# Altium schematic sheet bolid-mcu.SchDoc
size A3
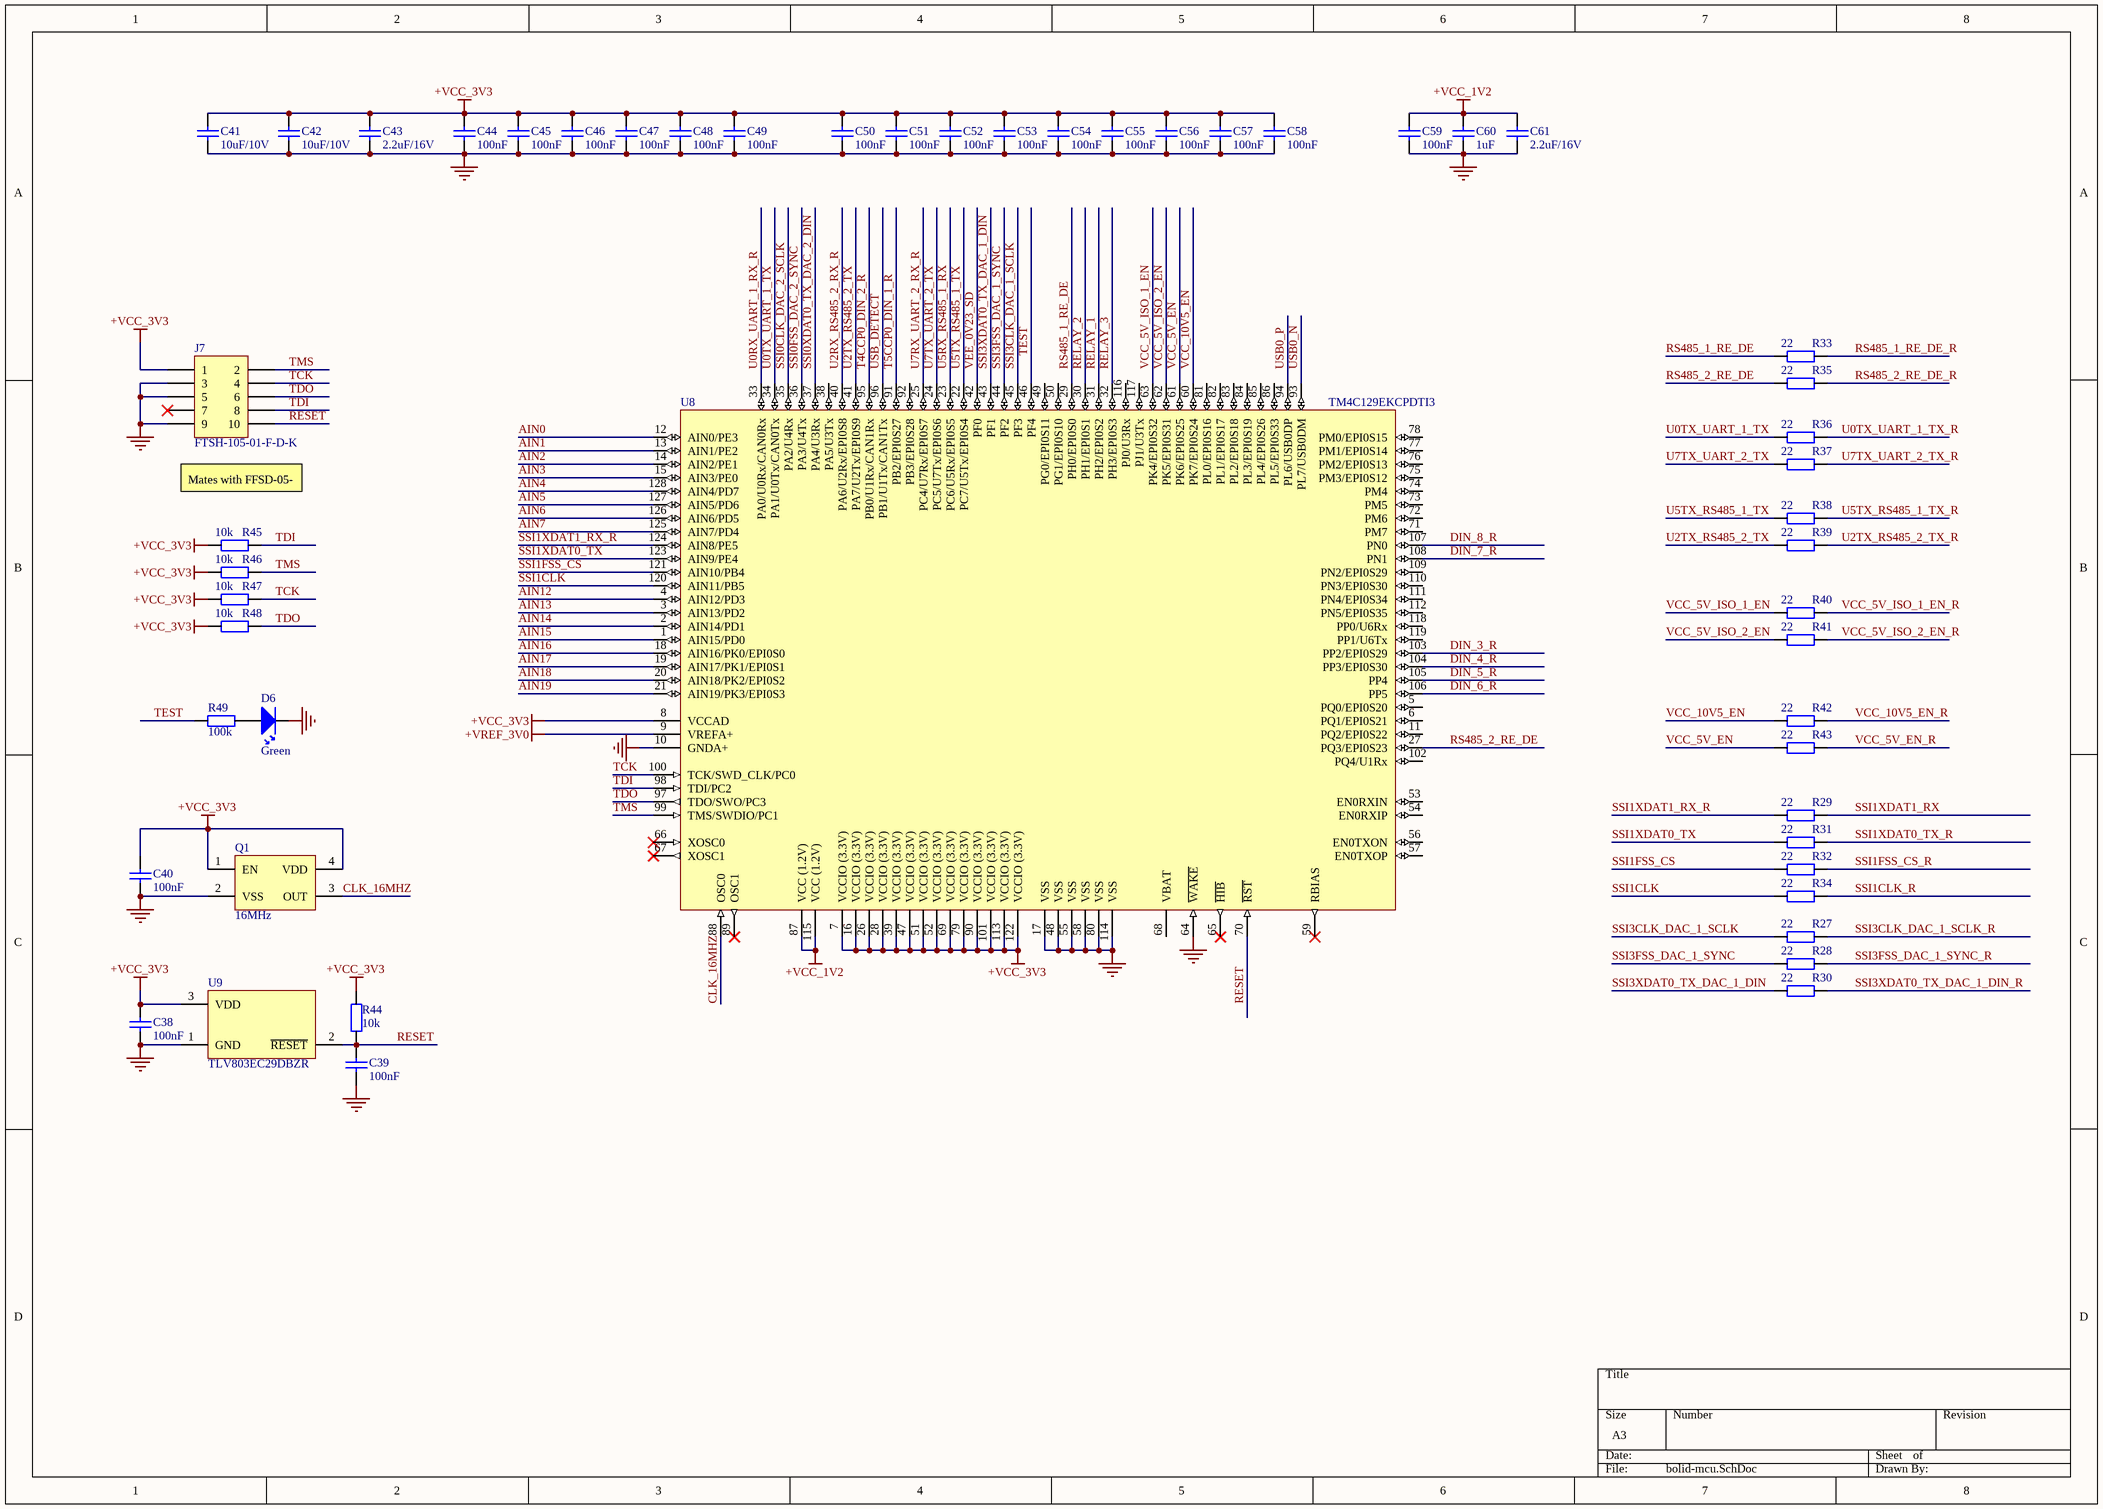
[diagram p0: bolid-mcu.SchDoc]

## Parts
C38  Value Displayed: 100nF  [C0402-CAPC100X50X55L22 - Tayio Yuden TDK]  (hidden comment: GRM155R71H104KE14D)
C39  Value Displayed: 100nF  [C0402-CAPC100X50X55L22 - Tayio Yuden TDK]  (hidden comment: GRM155R71H104KE14D)
C40  Value Displayed: 100nF  [C0402-CAPC100X50X55L22 - Tayio Yuden TDK]  (hidden comment: GRM155R71H104KE14D)
C41  Value Displayed: 10uF/10V  [C0805-CAPC200X125X135L50N - Taiyo YudenN]  (hidden comment: GRM21BR71A106KA73K)
C42  Value Displayed: 10uF/10V  [C0805-CAPC200X125X135L50N - Taiyo YudenN]  (hidden comment: GRM21BR71A106KA73K)
C43  Value Displayed: 2.2uF/16V  [C0603-CAPC162X80X95L35N]  (hidden comment: EMK107BB7225MA-T)
C44  Value Displayed: 100nF  [C0402-CAPC100X50X55L22 - Tayio Yuden TDK]  (hidden comment: GRM155R71H104KE14D)
C45  Value Displayed: 100nF  [C0402-CAPC100X50X55L22 - Tayio Yuden TDK]  (hidden comment: GRM155R71H104KE14D)
C46  Value Displayed: 100nF  [C0402-CAPC100X50X55L22 - Tayio Yuden TDK]  (hidden comment: GRM155R71H104KE14D)
C47  Value Displayed: 100nF  [C0402-CAPC100X50X55L22 - Tayio Yuden TDK]  (hidden comment: GRM155R71H104KE14D)
C48  Value Displayed: 100nF  [C0402-CAPC100X50X55L22 - Tayio Yuden TDK]  (hidden comment: GRM155R71H104KE14D)
C49  Value Displayed: 100nF  [C0402-CAPC100X50X55L22 - Tayio Yuden TDK]  (hidden comment: GRM155R71H104KE14D)
C50  Value Displayed: 100nF  [C0402-CAPC100X50X55L22 - Tayio Yuden TDK]  (hidden comment: GRM155R71H104KE14D)
C51  Value Displayed: 100nF  [C0402-CAPC100X50X55L22 - Tayio Yuden TDK]  (hidden comment: GRM155R71H104KE14D)
C52  Value Displayed: 100nF  [C0402-CAPC100X50X55L22 - Tayio Yuden TDK]  (hidden comment: GRM155R71H104KE14D)
C53  Value Displayed: 100nF  [C0402-CAPC100X50X55L22 - Tayio Yuden TDK]  (hidden comment: GRM155R71H104KE14D)
C54  Value Displayed: 100nF  [C0402-CAPC100X50X55L22 - Tayio Yuden TDK]  (hidden comment: GRM155R71H104KE14D)
C55  Value Displayed: 100nF  [C0402-CAPC100X50X55L22 - Tayio Yuden TDK]  (hidden comment: GRM155R71H104KE14D)
C56  Value Displayed: 100nF  [C0402-CAPC100X50X55L22 - Tayio Yuden TDK]  (hidden comment: GRM155R71H104KE14D)
C57  Value Displayed: 100nF  [C0402-CAPC100X50X55L22 - Tayio Yuden TDK]  (hidden comment: GRM155R71H104KE14D)
C58  Value Displayed: 100nF  [C0402-CAPC100X50X55L22 - Tayio Yuden TDK]  (hidden comment: GRM155R71H104KE14D)
C59  Value Displayed: 100nF  [C0402-CAPC100X50X55L22 - Tayio Yuden TDK]  (hidden comment: GRM155R71H104KE14D)
C60  Value Displayed: 1uF  [C0603-CAPC162X80X95L35N]  (hidden comment: UMK107AB7105KA-T)
C61  Value Displayed: 2.2uF/16V  [C0603-CAPC162X80X95L35N]  (hidden comment: EMK107BB7225MA-T)
D6  Illumination Color: Green  [D0603 DIONC166X84X36L42N Littelfuse]  (hidden comment: 150060GS75000)
J7  FTSH-105-01-F-D-K  [SAMTEC-FTSH-105-01-F-D-K]
Q1  value 16MHz  [ECS ECS-2520S OSCCC250X200X100L67X77]  (hidden comment: ECS-2520MVLC-160-CN-TR)
R27  value 22  [R0402-RESC100X50X40L22N]  (hidden comment: RC0402FR-1322RL)
R28  value 22  [R0402-RESC100X50X40L22N]  (hidden comment: RC0402FR-1322RL)
R29  value 22  [R0402-RESC100X50X40L22N]  (hidden comment: RC0402FR-1322RL)
R30  value 22  [R0402-RESC100X50X40L22N]  (hidden comment: RC0402FR-1322RL)
R31  value 22  [R0402-RESC100X50X40L22N]  (hidden comment: RC0402FR-1322RL)
R32  value 22  [R0402-RESC100X50X40L22N]  (hidden comment: RC0402FR-1322RL)
R33  value 22  [R0402-RESC100X50X40L22N]  (hidden comment: RC0402FR-1322RL)
R34  value 22  [R0402-RESC100X50X40L22N]  (hidden comment: RC0402FR-1322RL)
R35  value 22  [R0402-RESC100X50X40L22N]  (hidden comment: RC0402FR-1322RL)
R36  value 22  [R0402-RESC100X50X40L22N]  (hidden comment: RC0402FR-1322RL)
R37  value 22  [R0402-RESC100X50X40L22N]  (hidden comment: RC0402FR-1322RL)
R38  value 22  [R0402-RESC100X50X40L22N]  (hidden comment: RC0402FR-1322RL)
R39  value 22  [R0402-RESC100X50X40L22N]  (hidden comment: RC0402FR-1322RL)
R40  value 22  [R0402-RESC100X50X40L22N]  (hidden comment: RC0402FR-1322RL)
R41  value 22  [R0402-RESC100X50X40L22N]  (hidden comment: RC0402FR-1322RL)
R42  value 22  [R0402-RESC100X50X40L22N]  (hidden comment: RC0402FR-1322RL)
R43  value 22  [R0402-RESC100X50X40L22N]  (hidden comment: RC0402FR-1322RL)
R44  value 10k  [R0402-RESC100X50X40L22N]  (hidden comment: RC0402FR-0710KL)
R45  value 10k  [R0402-RESC100X50X40L22N]  (hidden comment: RC0402FR-0710KL)
R46  value 10k  [R0402-RESC100X50X40L22N]  (hidden comment: RC0402FR-0710KL)
R47  value 10k  [R0402-RESC100X50X40L22N]  (hidden comment: RC0402FR-0710KL)
R48  value 10k  [R0402-RESC100X50X40L22N]  (hidden comment: RC0402FR-0710KL)
R49  value 100k  [R0402-RESC100X50X40L22N]  (hidden comment: RC0402FR-07100KL)
U8  TM4C129EKCPDTI3  [TI TQFP128 PDT S-PQFP-G128 QFP128P40_1600X1600X105L60X18NN]
U9  TLV803EC29DBZR  [TI SOT23 DBZ0003A SOT23-3P95_237X112L40X40N]

## Nets
+VCC_1V2: C59.2 C60.2 C61.2 U8.87(VCC_(1.2V)) U8.115(VCC_(1.2V))
+VCC_3V3: C38.2 C40.2 C41.2 C42.2 C43.2 C44.2 C45.2 C46.2 C47.2 C48.2 C49.2 C50.2 C51.2 C52.2 C53.2 C54.2 C55.2 C56.2 C57.2 C58.2 J7.1 Q1.1(EN) Q1.4(VDD) R44.1 R45.2 R46.2 R47.2 R48.2 U8.7(VCCIO_(3.3V)) U8.8(VCCAD) U8.16(VCCIO_(3.3V)) U8.26(VCCIO_(3.3V)) U8.28(VCCIO_(3.3V)) U8.39(VCCIO_(3.3V)) U8.47(VCCIO_(3.3V)) U8.51(VCCIO_(3.3V)) U8.52(VCCIO_(3.3V)) U8.69(VCCIO_(3.3V)) U8.79(VCCIO_(3.3V)) U8.90(VCCIO_(3.3V)) U8.101(VCCIO_(3.3V)) U8.113(VCCIO_(3.3V)) U8.122(VCCIO_(3.3V)) U9.3(VDD)
+VREF_3V0: U8.9(VREFA+)
GND: C38.1 C39.1 C40.1 C41.1 C42.1 C43.1 C44.1 C45.1 C46.1 C47.1 C48.1 C49.1 C50.1 C51.1 C52.1 C53.1 C54.1 C55.1 C56.1 C57.1 C58.1 C59.1 C60.1 C61.1 D6.1(K) J7.3 J7.5 J7.9 Q1.2(VSS) U8.10(GNDA+) U8.17(VSS) U8.48(VSS) U8.55(VSS) U8.58(VSS) U8.64(~{WAKE}) U8.80(VSS) U8.114(VSS) U9.1(GND)
AIN0: U8.12(AIN0/PE3)
AIN1: U8.13(AIN1/PE2)
AIN2: U8.14(AIN2/PE1)
AIN3: U8.15(AIN3/PE0)
AIN4: U8.128(AIN4/PD7)
AIN5: U8.127(AIN5/PD6)
AIN6: U8.126(AIN6/PD5)
AIN7: U8.125(AIN7/PD4)
AIN12: U8.4(AIN12/PD3)
AIN13: U8.3(AIN13/PD2)
AIN14: U8.2(AIN14/PD1)
AIN15: U8.1(AIN15/PD0)
AIN16: U8.18(AIN16/PK0/EPI0S0)
AIN17: U8.19(AIN17/PK1/EPI0S1)
AIN18: U8.20(AIN18/PK2/EPI0S2)
AIN19: U8.21(AIN19/PK3/EPI0S3)
CLK_16MHZ: Q1.3(OUT) U8.88(OSC0)
DIN_3_R: U8.103(PP2/EPI0S29)
DIN_4_R: U8.104(PP3/EPI0S30)
DIN_5_R: U8.105(PP4)
DIN_6_R: U8.106(PP5)
DIN_7_R: U8.108(PN1)
DIN_8_R: U8.107(PN0)
RELAY_1: U8.31(PH2/EPI0S2)
RELAY_2: U8.30(PH1/EPI0S1)
RELAY_3: U8.32(PH3/EPI0S3)
RESET: C39.2 J7.10 R44.2 U8.70(~{RST}) U9.2(~{RESET})
RS485_1_RE_DE: R33.1 U8.29(PH0/EPI0S0)
RS485_1_RE_DE_R: R33.2
RS485_2_RE_DE: R35.1 U8.27(PQ3/EPI0S23)
RS485_2_RE_DE_R: R35.2
SSI0CLK_DAC_2_SCLK: U8.35(PA2/U4Rx)
SSI0FSS_DAC_2_SYNC: U8.36(PA3/U4Tx)
SSI0XDAT0_TX_DAC_2_DIN: U8.37(PA4/U3Rx)
SSI1CLK: R34.1 U8.120(AIN11/PB5)
SSI1CLK_R: R34.2
SSI1FSS_CS: R32.1 U8.121(AIN10/PB4)
SSI1FSS_CS_R: R32.2
SSI1XDAT0_TX: R31.1 U8.123(AIN9/PE4)
SSI1XDAT0_TX_R: R31.2
SSI1XDAT1_RX: R29.2
SSI1XDAT1_RX_R: R29.1 U8.124(AIN8/PE5)
SSI3CLK_DAC_1_SCLK: R27.1 U8.45(PF3)
SSI3CLK_DAC_1_SCLK_R: R27.2
SSI3FSS_DAC_1_SYNC: R28.1 U8.44(PF2)
SSI3FSS_DAC_1_SYNC_R: R28.2
SSI3XDAT0_TX_DAC_1_DIN: R30.1 U8.43(PF1)
SSI3XDAT0_TX_DAC_1_DIN_R: R30.2
T4CCP0_DIN_2_R: U8.95(PB0/U1Rx/CAN1Rx)
T5CCP0_DIN_1_R: U8.91(PB2/EPI0S27)
TCK: J7.4 R47.1 U8.100(TCK/SWD_CLK/PC0)
TDI: J7.8 R45.1 U8.98(TDI/PC2)
TDO: J7.6 R48.1 U8.97(TDO/SWO/PC3)
TEST: R49.2 U8.46(PF4)
TMS: J7.2 R46.1 U8.99(TMS/SWDIO/PC1)
U0RX_UART_1_RX_R: U8.33(PA0/U0Rx/CAN0Rx)
U0TX_UART_1_TX: R36.1 U8.34(PA1/U0Tx/CAN0Tx)
U0TX_UART_1_TX_R: R36.2
U2RX_RS485_2_RX_R: U8.40(PA6/U2Rx/EPI0S8)
U2TX_RS485_2_TX: R39.1 U8.41(PA7/U2Tx/EPI0S9)
U2TX_RS485_2_TX_R: R39.2
U5RX_RS485_1_RX: U8.23(PC6/U5Rx/EPI0S5)
U5TX_RS485_1_TX: R38.1 U8.22(PC7/U5Tx/EPI0S4)
U5TX_RS485_1_TX_R: R38.2
U7RX_UART_2_RX_R: U8.25(PC4/U7Rx/EPI0S7)
U7TX_UART_2_TX: R37.1 U8.24(PC5/U7Tx/EPI0S6)
U7TX_UART_2_TX_R: R37.2
USB0_N: U8.93(PL7/USB0DM)
USB0_P: U8.94(PL6/USB0DP)
USB_DETECT: U8.96(PB1/U1Tx/CAN1Tx)
VCC_5V_EN: R43.1 U8.61(PK6/EPI0S25)
VCC_5V_EN_R: R43.2
VCC_5V_ISO_1_EN: R40.1 U8.63(PK4/EPI0S32)
VCC_5V_ISO_1_EN_R: R40.2
VCC_5V_ISO_2_EN: R41.1 U8.62(PK5/EPI0S31)
VCC_5V_ISO_2_EN_R: R41.2
VCC_10V5_EN: R42.1 U8.60(PK7/EPI0S24)
VCC_10V5_EN_R: R42.2
VEE_0V23_SD: U8.42(PF0)
NetD6_2: D6.2(A) R49.1

Not connected (* = marked no-connect by the designer): J7 7*; U8 5(PQ0/EPI0S20) 6(PQ1/EPI0S21) 11(PQ2/EPI0S22) 38(PA5/U3Tx) 49(PG0/EPI0S11) 50(PG1/EPI0S10) 53(EN0RXIN) 54(EN0RXIP) 56(EN0TXON) 57(EN0TXOP) 59(RBIAS)* 65(~{HIB})* 66(XOSC0)* 67(XOSC1)* 68(VBAT) 71(PM7) 72(PM6) 73(PM5) 74(PM4) 75(PM3/EPI0S12) 76(PM2/EPI0S13) 77(PM1/EPI0S14) 78(PM0/EPI0S15) 81(PL0/EPI0S16) 82(PL1/EPI0S17) 83(PL2/EPI0S18) 84(PL3/EPI0S19) 85(PL4/EPI0S26) 86(PL5/EPI0S33) 89(OSC1)* 92(PB3/EPI0S28) 102(PQ4/U1Rx) 109(PN2/EPI0S29) 110(PN3/EPI0S30) 111(PN4/EPI0S34) 112(PN5/EPI0S35) 116(PJ0/U3Rx) 117(PJ1/U3Tx) 118(PP0/U6Rx) 119(PP1/U6Tx)

## Notes on the sheet
- Mates with FFSD-05-

## Library data of the parts
C38-C40 C44-C59 = GRM155R71H104KE14D: MLCC 0402 (1005) 100nF 10% 50V X7R; Manufacturer: Murata Electronics; Capacitance: 0.1 uF; Type: Chip Multilayer Ceramic Capacitor for General Purpose; Voltage Rating DC: 50 VDC; Capacitance - pF: 100000 pF; Class: Class 2; Supplier 1: Mouser; Manufacturer Part Number: GRM155R71H104KE14D; RoHS: RoHS Compliant; Category: Multilayer Ceramic Capacitors MLCC - SMD/SMT; Stock 1: 3511637; Pricing 1: 1=0.090, 10=0.038, 100=0.016, 500=0.012, 1000=0.009, 2500=0.008, 5000=0.007, 10000=0.005 (EUR); Height: 0.5 mm; Length: 1 mm; Package / Case: 0402 (1005 metric); Packaging: Cut Tape; Product: General Type MLCCs; Series: GRM; Termination Style: SMD/SMT; Tolerance: 10 %; Width: 0.5 mm; Brand: Murata Electronics; Capacitance - nF: 100 nF; Case Code - in: 0402; Case Code - mm: 1005; Dielectric: X7R; Maximum Operating Temperature: + 125 C; Minimum Operating Temperature: - 55 C; Product Type: Ceramic Capacitors; Standard Pack Qty: 10000; Subcategory: Capacitors; Termination: Standard; RoHS - Mouser: Y; Minimum Order Quantity: 1; Reeling: True; ComponentLink1URL: https://www.mouser.com/datasheet/2/281/murata_03052018_GRM_Series_1-1310166.pdf; ComponentLink1Description: https://www.mouser.com/datasheet/2/281/murata_03052018_GRM_Series_1-1310166.pdf; Value: 100nF; Supplier Part Number 1: 81-GRM155R71H104KE4D
C41 C42 = GRM21BR71A106KA73K: MLCC 0805 (2012) 10uF 10% 10V X7R; Manufacturer: Murata Electronics; Type: Chip Multilayer Ceramic Capacitor for General Purpose; Voltage Rating DC: 10 VDC; Class: Class 2; Value: 10u; Supplier 1: Mouser; Manufacturer Part Number: GRM21BR71A106KA73K; RoHS: RoHS Compliant; Category: Multilayer Ceramic Capacitors MLCC - SMD/SMT; Stock 1: 108729; Pricing 1: 1=0.207, 10=0.144, 100=0.072, 500=0.050, 1000=0.043, 2500=0.040, 5000=0.036, 10000=0.030, 20000=0.028 (EUR); Capacitance: 10 uF; Height: 1.25 mm; Length: 2 mm; Package / Case: 0805 (2012 metric); Packaging: Cut Tape; Product: General Type MLCCs; Series: GRM; Termination Style: SMD/SMT; Tolerance: 10 %; Width: 1.25 mm; Brand: Murata Electronics; Case Code - in: 0805; Case Code - mm: 2012; Dielectric: X7R; Maximum Operating Temperature: + 125 C; Minimum Operating Temperature: - 55 C; Product Type: Ceramic Capacitors; Standard Pack Qty: 10000; Subcategory: Capacitors; Termination: Standard; RoHS - Mouser: Y; Minimum Order Quantity: 1; Reeling: True; ComponentLink1URL: https://www.mouser.com/datasheet/2/281/murata_03052018_GRM_Series_1-1310166.pdf; ComponentLink1Description: https://www.mouser.com/datasheet/2/281/murata_03052018_GRM_Series_1-1310166.pdf; Supplier Part Number 1: 81-GRM21BR71A106KA3K
C43 C61 = EMK107BB7225MA-T: MLCC 0603 (1608) 2.2uF 20% 16V X7R; Manufacturer: Taiyo Yuden; Type: AECStandardQ200; Voltage Rating DC: 16 VDC; Capacitance - nF: 2200 nF; Value: 2.2u; Supplier 1: Mouser; Manufacturer Part Number: EMK107BB7225MA-T; RoHS: RoHS Compliant; Category: Multilayer Ceramic Capacitors MLCC - SMD/SMT; Stock 1: 5687; Pricing 1: 1=0.324, 10=0.228, 100=0.129, 500=0.090, 1000=0.078, 4000=0.060, 8000=0.057, 12000=0.055, 24000=0.048 (EUR); Capacitance: 2.2 uF; Height: 0.8 mm; Length: 1.6 mm; Package / Case: 0603 (1608 metric); Packaging: Cut Tape; Product: Automotive MLCCs; Series: M; Termination Style: SMD/SMT; Tolerance: 20 %; Width: 0.8 mm; Brand: Taiyo Yuden; Case Code - in: 0603; Case Code - mm: 1608; Dielectric: X7R; Maximum Operating Temperature: + 125 C; Minimum Operating Temperature: - 55 C; Product Type: Ceramic Capacitors; Standard Pack Qty: 4000; Subcategory: Capacitors; Termination: Standard; RoHS - Mouser: Y; Minimum Order Quantity: 1; Reeling: True; ComponentLink1URL: https://www.mouser.com/datasheet/2/396/mlcc02_e-1307760.pdf; ComponentLink1Description: https://www.mouser.com/datasheet/2/396/mlcc02_e-1307760.pdf; Supplier Part Number 1: 963-EMK107BB7225MA-T
C60 = UMK107AB7105KA-T: MLCC 0603 (1608) 1uF 10% 50V X7R; Manufacturer: Taiyo Yuden; Type: General Purpose; Voltage Rating DC: 50 VDC; Capacitance - nF: 1000 nF; Class: Class 2; Supplier 1: Mouser; Manufacturer Part Number: UMK107AB7105KA-T; RoHS: RoHS Compliant; Category: Multilayer Ceramic Capacitors MLCC - SMD/SMT; Stock 1: 55691; Pricing 1: 1=0.271, 10=0.160, 100=0.108, 500=0.076, 1000=0.067, 4000=0.049 (USD); Capacitance: 1 uF; Diameter: -; Height: 0.8 mm; Length: 1.6 mm; Package / Case: 0603 (1608 metric); Packaging: Cut Tape; Product: General Type MLCCs; Series: M; Termination Style: SMD/SMT; Tolerance: 10 %; Width: 0.8 mm; Brand: Taiyo Yuden; Case Code - in: 0603; Case Code - mm: 1608; Dielectric: X7R; Maximum Operating Temperature: + 125 C; Minimum Operating Temperature: - 55 C; Product Type: Ceramic Capacitors; Standard Pack Qty: 4000; Subcategory: Capacitors; Termination: Standard; RoHS - Mouser: Y; Minimum Order Quantity: 1; Reeling: True; ComponentLink1URL: https://www.mouser.com/datasheet/2/396/mlcc02_e-1307760.pdf; ComponentLink1Description: https://www.mouser.com/datasheet/2/396/mlcc02_e-1307760.pdf; Supplier Part Number 1: 963-UMK107AB7105KA-T; Value: 1uF
D6 = 150060GS75000: LED 0603 (1608) Green; Manufacturer: Wurth Elektronik; Lens Color/Style: Water Clear; Power Rating: 105 mW; Lens Shape: Rectangular; Luminous Intensity: 430 mcd; Peak Wavelength: 515 nm; Viewing Angle: 140 deg; If - Forward Current: 20 mA; Vf - Forward Voltage: 3.2 V; Vr - Reverse Voltage: 5 V; Wavelength/Color Temperature: 520 nm; Supplier 1: Mouser; Manufacturer Part Number: 150060GS75000; RoHS: RoHS Compliant; Category: Standard LEDs - SMD; Stock 1: 17312; Pricing 1: 1=0.130, 10=0.126, 50=0.115, 100=0.099, 500=0.085, 4000=0.085 (EUR); Height: 0.7 mm; Length: 1.6 mm; Package / Case: 0603 (1608 metric); Packaging: Cut Tape; Product: Green LEDs; Series: WL-SMCW; Width: 0.8 mm; Brand: Wurth Elektronik; Mounting Style: SMD/SMT; Lens Dimensions: 1.1 mm x 0.8 mm; Lens Transparency: Water Clear; Maximum Operating Temperature: + 85 C; Minimum Operating Temperature: - 40 C; Moisture Sensitive: Yes; Product Type: LED - Standard; Standard Pack Qty: 4000; Subcategory: LEDs; RoHS - Mouser: Y; Minimum Order Quantity: 1; Reeling: True; ComponentLink1URL: https://www.mouser.com/datasheet/2/445/150060GS75000-368921.pdf; ComponentLink1Description: https://www.mouser.com/datasheet/2/445/150060GS75000-368921.pdf; Supplier Part Number 1: 710-150060GS75000
J7 = FTSH-105-01-F-D-K: Conn Unshrouded Header HDR 10 POS 1.27mm Solder ST Top Entry Thru-Hole Tube; Manufacturer: Samtec; Max Current Rating: 1.75A; Number of Positions: 10; Row Spacing: 0.05inch; Supplier 1: Mouser; Manufacturer Part Number: FTSH-105-01-F-D-K; RoHS: Yes; Category: Headers and Wire Housings; Stock 1: 22277; Pricing 1: 1=2,13, 10=2,13, 50=2,13, 100=2,13, 1000=1,34, 10000=0,99 (USD); Mount: Through Hole; Contact Plating: Gold; Contact Material: Bronze; Color: Black; Housing Color: Black; Housing Material: Polymer; Min Operating Temperature: -55°C; Max Operating Temperature: 125°C; Number of Rows: 2; Packaging: Rail/Tube; Package Quantity: 1; Termination: Solder; Number of Contacts: 10; Orientation: Straight; Series: FTSH; Contact Type: Male Pin; Length: 6.35mm; Pitch: 1.27mm; Contact Mating Length: 0.12inch; Depth: 3.43mm; Radiation Hardening: No; RoHS Compliant: Yes; ComponentLink1URL: https://datasheet.ciiva.com/15195/getdatasheetpartid-257317-15195258.pdf?src-supplier=Verical; ComponentLink1Description: https://datasheet.ciiva.com/15195/getdatasheetpartid-257317-15195258.pdf?src-supplier=Verical; ComponentLink2URL: https://datasheet.ciiva.com/727/ftsh-1xx-xx-xxx-d-xx-mkt-727195.pdf?src-supplier=Digikey; ComponentLink2Description: https://datasheet.ciiva.com/727/ftsh-1xx-xx-xxx-d-xx-mkt-727195.pdf?src-supplier=Digikey; Supplier Part Number 1: 200-FTSH10501FDK
Q1 = ECS-2520MVLC-160-CN-TR: Oscillator XO 16MHz ±25ppm 15pF CMOS 55% 1.8V/2.5V/3.3V 4-Pin Mini-CSMD T/R; Manufacturer: ECS International; Supplier 1: Mouser; Manufacturer Part Number: ECS-2520MVLC-160-CN-TR; RoHS: No; Stock 1: 1840; Pricing 1: 1=1,39000, 10=1,33000, 50=1,30000, 100=1,11000, 500=1,08000, 1000=0,90800, 10000=0,90800 (USD); Supplier Part Number 1: 520-2520MVLC-160CNTR
R27-R43 = RC0402FR-1322RL: RES 0402 (1005) 22.0 ohm 1% 0.0625W 50V Thick Film; Manufacturer: Yageo; Resistance: 22R; Power Rating: 62.5mW; Temperature Coefficient: 100ppm/°C; Supplier 1: Mouser; Manufacturer Part Number: RC0402FR-1322RL; RoHS: Yes; Category: Chip SMD Resistors; Stock 1: 130563; Pricing 1: 1=0,10000, 10=0,01200, 50=0,01200, 100=0,00500, 1000=0,00300, 10000=0,00300 (USD); Case/Package: 0402; Case Code (Imperial): 0402; Case Code (Metric): 1005; Weight: 2.3E-05oz; Contact Plating: Tin,Matte; Size Code: 0402; Min Operating Temperature: -55°C; Max Operating Temperature: 155°C; Voltage Rating: 50V; Tolerance: 1%; Packaging: Tape and Reel; Resistor Type: Thick Film; Termination: SMD/SMT; Series: RC; Length: 1mm; Width: 0.5mm; Height: 0.35mm; Radiation Hardening: No; Lead Free: Lead Free; RoHS Compliant: Yes; ComponentLink1URL: https://datasheet.ciiva.com/17423/pyu-rc0402-51-rohs-l-6-r-17423721.pdf?src-supplier=Future+Electronics; ComponentLink1Description: https://datasheet.ciiva.com/17423/pyu-rc0402-51-rohs-l-6-r-17423721.pdf?src-supplier=Future+Electronics; ComponentLink2URL: https://datasheet.ciiva.com/8890/pyu-rc0402-51-rohs-l-6-8890187.pdf?src-supplier=Avnet; ComponentLink2Description: https://datasheet.ciiva.com/8890/pyu-rc0402-51-rohs-l-6-8890187.pdf?src-supplier=Avnet; Supplier Part Number 1: 603-RC0402FR-1322RL
R44-R48 = RC0402FR-0710KL: RES 0402 (1005) 10.0k 1% 0.0625W 50V Thick Film; Manufacturer: Yageo; Power Rating: 62.5 mW, 125 mW; Resistance: 10 kOhms; Temperature Coefficient: 100 PPM / C; Supplier 1: Mouser; Manufacturer Part Number: RC0402FR-0710KL; RoHS: RoHS Compliant; Category: Thick Film Resistors - SMD; Stock 1: 20942447; Pricing 1: 1=0.090, 10=0.011, 100=0.004, 1000=0.003, 10000=0.003 (EUR); Application: High Reliability; Features: -; Height: 0.35 mm; Length: 1 mm; Package / Case: -; Packaging: Cut Tape; Product: Thick Film Resistors SMD; Series: RC; Technology: Thick Film; Termination Style: SMD/SMT; Tolerance: 1 %; Type: General Purpose; Voltage Rating: 50 V; Width: 0.5 mm; Brand: Yageo; Mounting Style: PCB Mount; Case Code - in: 0402; Case Code - mm: 1005; Maximum Operating Temperature: + 155 C; Minimum Operating Temperature: - 55 C; Product Type: Thick Film Resistors; Standard Pack Qty: 10000; Subcategory: Resistors; RoHS - Mouser: Y; Minimum Order Quantity: 1; Reeling: True; ComponentLink1URL: https://www.mouser.com/datasheet/2/447/PYu-RC_Group_51_RoHS_L_10-1664068.pdf; ComponentLink1Description: https://www.mouser.com/datasheet/2/447/PYu-RC_Group_51_RoHS_L_10-1664068.pdf; Supplier Part Number 1: 603-RC0402FR-0710KL
R49 = RC0402FR-07100KL: RES 0402 (1005) 100.0k 1% 0.0625W 50V Thick Film; Manufacturer: Yageo; Power Rating: 62.5 mW, 125 mW; Resistance: 100 kOhms; Temperature Coefficient: 100 PPM / C; Supplier 1: Mouser; Manufacturer Part Number: RC0402FR-07100KL; RoHS: RoHS Compliant; Category: Thick Film Resistors - SMD; Stock 1: 2491111; Pricing 1: 1=0.090, 10=0.011, 100=0.004, 1000=0.003, 10000=0.003 (EUR); Application: High Reliability; Features: -; Height: 0.35 mm; Length: 1 mm; Package / Case: -; Packaging: Cut Tape; Product: Thick Film Resistors SMD; Series: RC; Technology: Thick Film; Termination Style: SMD/SMT; Tolerance: 1 %; Type: General Purpose; Voltage Rating: 50 V; Width: 0.5 mm; Brand: Yageo; Mounting Style: PCB Mount; Case Code - in: 0402; Case Code - mm: 1005; Maximum Operating Temperature: + 155 C; Minimum Operating Temperature: - 55 C; Product Type: Thick Film Resistors; Standard Pack Qty: 10000; Subcategory: Resistors; RoHS - Mouser: Y; Minimum Order Quantity: 1; Reeling: True; ComponentLink1URL: https://www.mouser.com/datasheet/2/447/PYu-RC_Group_51_RoHS_L_10-1664068.pdf; ComponentLink1Description: https://www.mouser.com/datasheet/2/447/PYu-RC_Group_51_RoHS_L_10-1664068.pdf; Supplier Part Number 1: 603-RC0402FR-07100KL
U8 = TM4C129EKCPDTI3: ARM Microcontrollers - MCU Tiva C Series Microcontroller; Manufacturer: Texas Instruments; Program Memory Type: Flash; Data RAM Size: 256 kB; Data RAM Type: SRAM; Data ROM Size: 6 kB; Data ROM Type: EEPROM; Interface Type: Ethernet, CAN, I2C, SSI, UART, USB; Number of I/Os: 90 I/O; ADC Resolution: 12 bit; Core: ARM Cortex M4; Data Bus Width: 32 bit; Maximum Clock Frequency: 120 MHz; Number of ADC Channels: 20 Channel; Number of Timers/Counters: 8 Timer; Operating Supply Voltage: 3.3 V; Processor Series: Tiva C; Supplier 1: Mouser; Manufacturer Part Number: TM4C129EKCPDTI3; RoHS: RoHS Compliant; Category: ARM Microcontrollers - MCU; Stock 1: 174; Pricing 1: 1=12.32, 10=11.33, 25=10.75, 100=9.57, 250=9.10, 500=8.51, 1000=7.81 (EUR); Package / Case: TQFP-128; Series: TM4C129EKCPDT; Brand: Texas Instruments; Mounting Style: SMD/SMT; Program Memory Size: 6 kB; Maximum Operating Temperature: + 105 C; Minimum Operating Temperature: - 40 C; Moisture Sensitive: Yes; Product Type: ARM Microcontrollers - MCU; Standard Pack Qty: 90; Subcategory: Microcontrollers - MCU; RoHS - Mouser: Y; Minimum Order Quantity: 1; Reeling: False; Supplier Part Number 1: 595-TM4C129EKCPDTI3
U9 = TLV803EC29DBZR: Supervisory Circuits Low-power 3-pin voltage supervisor (reset IC) with active-low open-drain reset 3-SOT-23 -40 to 125; Manufacturer: Texas Instruments; Accuracy: 0.5 %; Output Type: Active Low, Open Drain; Quiescent Current: 250 nA; Battery Backup Switching: No Backup; Chip Enable Signals: No Chip Enable; Number of Inputs Monitored: 1 Input; Operating Supply Current: 400 nA; Power Fail Detection: No; Reset Delay Time: 10 ms; Supply Voltage - Max: 6 V; Supply Voltage - Min: 1.7 V; Threshold Voltage: 2.9 V; Watchdog Timers: No Watchdog; Product Status: New Product; Supplier 1: Mouser; Manufacturer Part Number: TLV803EC29DBZR; Category: Supervisory Circuits; Stock 1: 2955; Pricing 1: 1=0.396, 10=0.315, 100=0.234, 250=0.198, 500=0.189, 1000=0.140, 3000=0.130, 6000=0.121, 9000=0.117 (EUR); Package / Case: SOT-23-3; Packaging: Cut Tape; Type: Voltage Supervisory; Brand: Texas Instruments; Manual Reset: Manual Reset; Mounting Style: SMD/SMT; Maximum Operating Temperature: + 125 C; Minimum Operating Temperature: - 40 C; Product Type: Supervisory Circuits; Standard Pack Qty: 3000; Subcategory: PMIC - Power Management ICs; Minimum Order Quantity: 1; Reeling: True; Supplier Part Number 1: 595-TLV803EC29DBZR